# EAGLE design prototype_total_schematic_2355 (EAGLE 8.4.1)
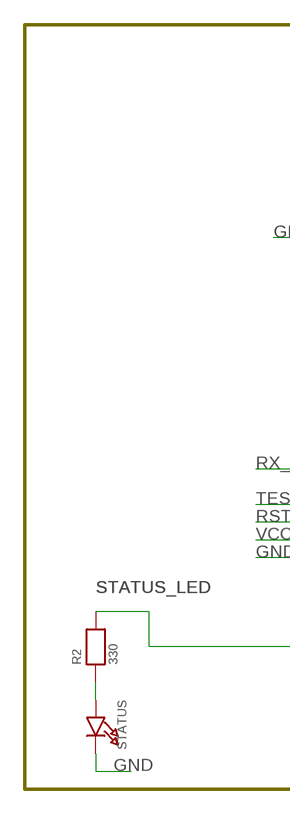
[diagram p0: schematic, sheet 1, part 1 of 2]
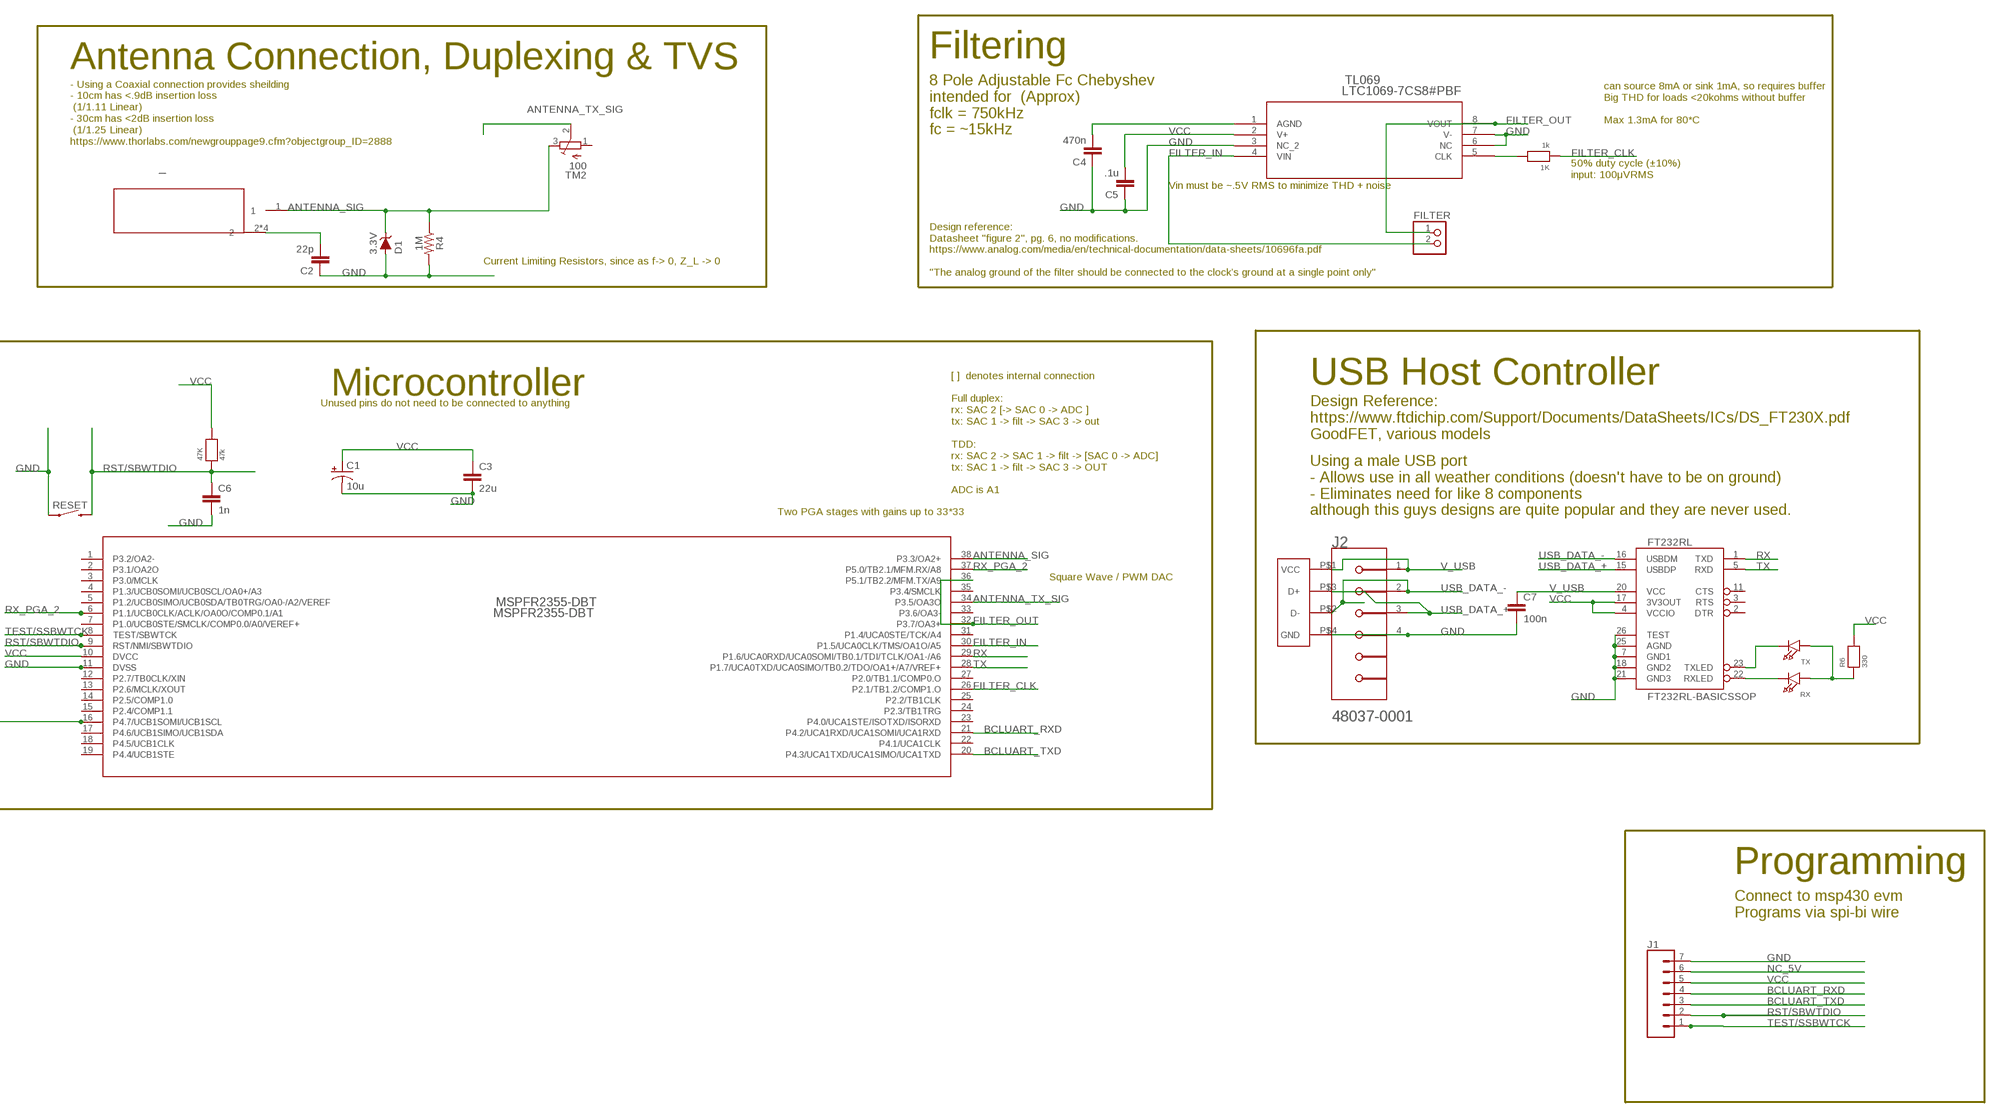
[diagram p1: schematic, sheet 1, part 2 of 2]

## Parts
1K  1k  RESISTOR0805  [0805]
47K  47k  RESISTOR0805  [0805]
_  5-1814400-1  [5-1814400-1]
C1  10u  10UF-POLAR-EIA6032-25V-10%  [EIA6032-NOM]
C2  22p  22UF-0805-6.3V-20%  [0805]
C3  22u  22UF-0805-6.3V-20%  [0805]
C4  470n  22UF-0805-6.3V-20%  [0805]
C5  .1u  22UF-0805-6.3V-20%  [0805]
C6  1n  22UF-0805-6.3V-20%  [0805]
C7  100n  22UF-0805-6.3V-20%  [0805]
D1  3.3V  DIODE-ZENER-MM3Z3V3T1G  [SOD-323]
FILTER  HEADER-1X2ROUND  [1X02_ROUND]
FT232RL  FT232RL-BASICSSOP  [SSOP28DB]
J1  CONN_07NO_SILK  [1X07_NO_SILK]
J2  MOLEX_48037-0001MOLEX_48037-0001_0_0  [MOLEX_48037-0001_0]
MSPFR2355-DBT  MSPFR2355-DBT  [SOP50P640X120-38N]
R2  330  RESISTOR0805  [0805]
R4  1M  2.0KOHM-0603-1/10W-5%  [0603]
R6  330  RESISTOR0805  [0805]
RESET  MOMENTARY-SWITCH-SPST-PTH-6.0MM  [TACTILE_SWITCH_PTH_6.0MM]
RX  LED0805  [CHIPLED_0805]
STATUS  LED0805  [CHIPLED_0805]
TL069  LTC1069-7CS8#PBF  [SO-8_S]
TM2  100  TRIMPOTTC33X  [TC33X]
TX  LED0805  [CHIPLED_0805]
U$1  USB-PCB  [PCB_USB]

## Nets
ANTENNA_SIG: _.1 D1.C MSPFR2355-DBT.38(P3.3/OA2+) R4.1 TM2.3(E)
ANTENNA_TX_SIG: MSPFR2355-DBT.34(P3.5/OA3O) TM2.2(S)
BCLUART_RXD: J1.4 MSPFR2355-DBT.21(P4.2/UCA1RXD/UCA1SOMI/UCA1RXD)
BCLUART_TXD: J1.3 MSPFR2355-DBT.20(P4.3/UCA1TXD/UCA1SIMO/UCA1TXD)
FILTER_CLK: 1K.1 MSPFR2355-DBT.26(P2.1/TB1.2/COMP1.O)
FILTER_IN: FILTER.2 MSPFR2355-DBT.30(P1.5/UCA0CLK/TMS/OA1O/A5) TL069.4(VIN)
FILTER_OUT: FILTER.1 MSPFR2355-DBT.32(P3.7/OA3+) MSPFR2355-DBT.36(P5.1/TB2.2/MFM.TX/A9) TL069.8(VOUT)
GND: C1.C(-) C2.1 C3.2 C4.1 C5.1 C6.2 C7.2 D1.A FT232RL.7(GND1) FT232RL.18(GND2) FT232RL.21(GND3) FT232RL.25(AGND) FT232RL.26(TEST) J1.7 J2.4 MSPFR2355-DBT.11(DVSS) R4.2 RESET.1 STATUS.C TL069.3(NC_2) TL069.6(NC) TL069.7(V-) U$1.P$4(GND)
N$1: 1K.2 TL069.5(CLK)
N$2: _.2 _.3 _.4 _.5 C2.2
N$3: C4.2 TL069.1(AGND)
N$19: R2.1 STATUS.A
N$20: FT232RL.22(RXLED) RX.C
N$21: FT232RL.23(TXLED) TX.C
N$22: R6.1 RX.A TX.A
NC_5V: J1.6
RST/SBWTDIO: 47K.1 C6.1 J1.2 MSPFR2355-DBT.9(RST/NMI/SBWTDIO) RESET.3
RX: FT232RL.1(TXD) MSPFR2355-DBT.29(P1.6/UCA0RXD/UCA0SOMI/TB0.1/TDI/TCLK/OA1-/A6)
RX_PGA_2: MSPFR2355-DBT.6(P1.1/UCB0CLK/ACLK/OA0O/COMP0.1/A1) MSPFR2355-DBT.37(P5.0/TB2.1/MFM.RX/A8)
STATUS_LED: MSPFR2355-DBT.16(P4.7/UCB1SOMI/UCB1SCL) R2.2
TEST/SSBWTCK: J1.1 MSPFR2355-DBT.8(TEST/SBWTCK)
TX: FT232RL.5(RXD) MSPFR2355-DBT.28(P1.7/UCA0TXD/UCA0SIMO/TB0.2/TDO/OA1+/A7/VREF+)
USB_DATA_+: FT232RL.15(USBDP) J2.3 U$1.P$3(D+)
USB_DATA_-: FT232RL.16(USBDM) J2.2 U$1.P$2(D-)
V_USB: C7.1 FT232RL.20(VCC) J2.1 U$1.P$1(VCC)
VCC: 47K.2 C1.A(+) C3.1 C5.2 FT232RL.4(VCCIO) FT232RL.17(3V3OUT) J1.5 MSPFR2355-DBT.10(DVCC) R6.2 TL069.2(V+)
Unconnected: FT232RL.2(DTR) FT232RL.3(RTS) FT232RL.11(CTS) MSPFR2355-DBT.1(P3.2/OA2-) MSPFR2355-DBT.2(P3.1/OA2O) MSPFR2355-DBT.5(P1.2/UCB0SIMO/UCB0SDA/TB0TRG/OA0-/A2/VEREF) MSPFR2355-DBT.7(P1.0/UCB0STE/SMCLK/COMP0.0/A0/VEREF+) MSPFR2355-DBT.12(P2.7/TB0CLK/XIN) MSPFR2355-DBT.13(P2.6/MCLK/XOUT) MSPFR2355-DBT.14(P2.5/COMP1.0) MSPFR2355-DBT.15(P2.4/COMP1.1) MSPFR2355-DBT.17(P4.6/UCB1SIMO/UCB1SDA) MSPFR2355-DBT.18(P4.5/UCB1CLK) MSPFR2355-DBT.19(P4.4/UCB1STE) MSPFR2355-DBT.22(P4.1/UCA1CLK) MSPFR2355-DBT.23(P4.0/UCA1STE/ISOTXD/ISORXD) MSPFR2355-DBT.24(P2.3/TB1TRG) MSPFR2355-DBT.25(P2.2/TB1CLK) MSPFR2355-DBT.27(P2.0/TB1.1/COMP0.O) MSPFR2355-DBT.31(P1.4/UCA0STE/TCK/A4) MSPFR2355-DBT.35(P3.4/SMCLK) TM2.1(A)

## Notes on the sheet
- Antenna Connection, Duplexing & TVS | Filtering
- can source 8mA or sink 1mA, so requires buffer
  Big THD for loads <20kohms without buffer
  
  Max 1.3mA for 80*C
- 8 Pole Adjustable Fc Chebyshev
  intended for  (Approx)
  fclk = 750kHz 
  fc = ~15kHz
- - Using a Coaxial connection provides sheilding
  - 10cm has <.9dB insertion loss
   (1/1.11 Linear)
  - 30cm has <2dB insertion loss
   (1/1.25 Linear)
  https://www.thorlabs.com/newgrouppage9.cfm?objectgroup_ID=2888
- 50% duty cycle (±10%)
  input: 100μVRMS
- Vin must be ~.5V RMS to minimize THD + noise
- Current Limiting Resistors, since as f-> 0, Z_L -> 0
- Design reference: 
  Datasheet "figure 2", pg. 6, no modifications.
  https://www.analog.com/media/en/technical-documentation/data-sheets/10696fa.pdf
  
  "The analog ground of the filter should be connected to the clock’s ground at a single point only"
- Microcontroller | USB Host Controller
- Unused pins do not need to be connected to anything
- Design Reference:
  https://www.ftdichip.com/Support/Documents/DataSheets/ICs/DS_FT230X.pdf
  GoodFET, various models
- [ ]  denotes internal connection
  
  Full duplex:
  rx: SAC 2 [-> SAC 0 -> ADC ]
  tx: SAC 1 -> filt -> SAC 3 -> out
  
  TDD:
  rx: SAC 2 -> SAC 1 -> filt -> [SAC 0 -> ADC]
  tx: SAC 1 -> filt -> SAC 3 -> OUT 
  
  ADC is A1
- Two PGA stages with gains up to 33*33
- Using a male USB port
  - Allows use in all weather conditions (doesn't have to be on ground)
  - Eliminates need for like 8 components 
  although this guys designs are quite popular and they are never used.
- Square Wave / PWM DAC
- Programming
- Connect to msp430 evm
  Programs via spi-bi wire

## Power pins joined to a net without a drawn wire
P1.3/UCB0SOMI/UCB0SCL/OA0+/A3: MSPFR2355-DBT.4(P1.3/UCB0SOMI/UCB0SCL/OA0+/A3)
P3.0/MCLK: MSPFR2355-DBT.3(P3.0/MCLK)
P3.6/OA3-: MSPFR2355-DBT.33(P3.6/OA3-)

## Library data of the parts
1K 47K R2 R6 = microbuilder:RESISTOR: Resistors 0402 - 0402 Surface Mount Package 22 Ohm 1% 1/16W [Digikey: 311-22.0LRTR-ND] 33 Ohm 5% 1/16W 1.0K 5% 1/16W 1.5K 5% 1/16W 2.0K 1% 1/16W 10.0K 1% 1/16W [Digikey: 311-10.0KLRTR-ND] 10.0K 5% 1/16W [Digikey: RMCF0402JT10K0TR-ND] 12.1K 1% 1/16W [Digikey: 311-22.0LRTR-ND] 100.0K 5% 1/16W 0603 - 0603 Surface Mount Package 0 Ohm 1/10 Watt 1% Resistor 15 Ohm 1/10 Watt 1% Resistor 33 Ohm 1/10 Watt 1% Resistor 49.9 Ohm 1/10 Watt 1% Resistor 100 Ohm 1/10 Watt 1% Resistor 150 Ohm 1/10 Watt 1% Resistor 240 Ohm 1/10 Watt 1% Resistor 390 Ohm 1/10 Watt 1% Resistor 560 Ohm 1/10 Watt 1% Resistor 680 Ohm 1/10 Watt 1% Resistor 750 Ohm 1/10 Watt 1% Resistor 1.0K Ohm 1/10 Watt 1% Resistor 1.5K Ohm 1/10 Watt 1% Resistor 2.0K Ohm 1/10 Watt 1% Resistor 2.2K Ohm 1/10 Watt 1% Resistor 3.3K Ohm 1/10 Watt 1% Resistor 4.7K Ohm 1/10 Watt 1% Resistor 10.0K Ohm 1/10 Watt 1% Resistor 12.0K Ohm 1/10 Watt 1% Resistor 12.1K Ohm 1/10 Watt 1% Resistor 20.0K Ohm 1/10 Watt 1% Resistor 33.0K Ohm 1/10 Watt 1% Resistor 100.0K Ohm 1/10 Watt 1% Resistor 0805 - 0805 Surface Mount Package 0 Ohm 1/8 Watt 1% Resistor 33 Ohm 1/8 Watt 1% Resistor 100 Ohm 1/8 Watt 1% Resistor 150 Ohm 1/8 Watt 1% Resistor 200 Ohm 1/8 Watt 1% Resistor 240 Ohm 1/8 Watt 1% Resistor 330 Ohm 1/8 Watt 1% Resistor 390 Ohm 1/8 Watt 1% Resistor 470 Ohm 1/8 Watt 1% Resistor 1.0K Ohm 1/8 Watt 1% Resistor 1.5K Ohm 1/8 Watt 1% Resistor 2.0K Ohm 1/8 Watt 1% Resistor 4.7K Ohm 1/8 Watt 1% Resistor 5.1K Ohm 1/8 Watt 1% Resistor 5.6K Ohm 1/8 Watt 1% Resistor 10.0K Ohm 1/8 Watt 1% Resistor 22.0K Ohm 1/8 Watt 1% Resistor 33.0K Ohm 1/8 Watt 1% Resistor 100K Ohm 1/8 Watt 1% Resistor 1206 - 1206 Surface Mount Package 2012 - 2010 Surface Mount Package 0.11 Ohm 1/2 Watt 1% Resistor - Digikey: RHM.11UCT-ND
_ = TTE:5-1814400-1; MANUFACTURER_PART_NUMBER: 518144001; VENDOR: TE Connectivity
C1 = SparkFun-Capacitors:10UF-POLAR: 10.0µF polarized capacitors A capacitor is a passive two-terminal electrical component used to store electrical energy temporarily in an electric field.; PROD_ID: CAP-12984; VALUE: 10µF
C2-C7 = SparkFun-Capacitors:22UF: 22µF ceramic capacitors A capacitor is a passive two-terminal electrical component used to store electrical energy temporarily in an electric field.; PROD_ID: CAP-08402; VALUE: 22uF
D1 = SparkFun-DiscreteSemi:DIODE-ZENER: Zener Diode A Zener diode allows current to flow from its anode to its cathode like a normal semiconductor diode, but it also permits current to flow in the reverse direction when its "Zener voltage" is reached. - WIkipedia; PROD_ID: DIO-11284
FILTER = microbuilder:HEADER-1X2: PIN HEADER
FT232RL = SparkFun:FT232RL-BASIC: USB UART This is the simplified version of the FT232RL unit. Only what you need, nothing you don't. Spark Fun Electronics SKU : COM-00650
J1 = SparkFun-Connectors:CONN_07: Multi connection point. Often used as Generic Header-pin footprint for 0.1 inch spaced/style header connections On any of the 0.1 inch spaced packages, you can populate with these: Break Away Headers - Straight <https://www.sparkfun.com/products/116> (PRT-00116) Break Away Male Headers - Right Angle <https://www.sparkfun.com/products/553> (PRT-00553) Female Headers <https://www.sparkfun.com/products/115> (PRT-00115) Break Away Headers - Machine Pin <https://www.sparkfun.com/products/117> (PRT-00117) Break Away Female Headers - Swiss Machine Pin <https://www.sparkfun.com/products/743> (PRT-00743) For SCREWTERMINALS and SPRING TERMINALS visit here: Screw Terimnals on SparkFun.com <https://www.sparkfun.com/search/results?term=Screw+Terminals> (5mm/3.5mm/2.54mm spacing) This device is also useful as a general connection point to wire up your design to another part of your project. Our various solder wires solder well into these plated through hole pads. Hook-Up Wire - Assortment (Stranded, 22 AWG) <https://www.sparkfun.com/products/11375> (PRT-11375) Hook-Up Wire - Assortment (Solid Core, 22 AWG) <https://www.sparkfun.com/products/11367> (PRT-11367) View the entire wire category on our website here <https://www.sparkfun.com/categories/141> Special notes: Molex polarized connector foot print use with SKU : PRT-08231 with associated crimp pins and housings. 1MM SMD Version SKU: PRT-10208 NOTES ON THE VARIANTS LOCK and LOCK_LONGPADS... This footprint was designed to help hold the alignment of a through-hole component (i.e. 6-pin header) while soldering it into place. You may notice that each hole has been shifted either up or down by 0.005 of an inch from it's more standard position (which is a perfectly straight line). This slight alteration caused the pins (the squares in the middle) to touch the edges of the holes. Because they are alternating, it causes a "brace" to hold the component in place. 0.005 has proven to be the perfect amount of "off-center" position when using our standard breakaway headers. Although looks a little odd when you look at the bare footprint, once you have a header in there, the alteration is very hard to notice. Also,if you push a header all the way into place, it is covered up entirely on the bottom side.
J2 = TTE:MOLEX_48037-0001: Universal Serial Bus (USB) Shielded I/O Plug, Type A, Right Angle, Through Hole, 0.76µm Gold (Au) Plating, PCB Thickness 1.20mm-1.60mm, Lead-Free; CENTROID_NOT_SPECIFIED: No; DATASHEET: http://www.molex.com/elqNow/elqRedir.htm?ref=http://www.molex.com/pdm_docs/sd/480370001_sd.pdf; DIGIKEY_DESCRIPTION: CONN PLUG USB 4POS RT ANG PCB; DIGIKEY_PART_NUMBER: WM17117-ND; IMPORTED_FROM: octopart; IS_FEMALE: yes; LEAD_FREE: yes; MF: Molex; MOUSER_PART_NUMBER: 538-48037-0001; MPN: 48037-0001; NUM_PINS: 2; OCTOPART_PART_NUMBER: 6671af1c981eb9b6; PACKAGE: CONN_USB_PTH_18MM8_12MM0; PREFIX: J; ROHS: yes; TEMPERATURE_RANGE_HIGH: +85°C; TEMPERATURE_RANGE_LOW: -20°C
MSPFR2355-DBT = TTE:MSPFR2355-DBT
R4 = SparkFun-Resistors:2.0KOHM: 2kΩ resistor A resistor is a passive two-terminal electrical component that implements electrical resistance as a circuit element. Resistors act to reduce current flow, and, at the same time, act to lower voltage levels within circuits. - Wikipedia; PROD_ID: RES-08296; VALUE: 2.0k
RESET = SparkFun-Switches:MOMENTARY-SWITCH-SPST: Momentary Switch (Pushbutton) - SPST Normally-open (NO) SPST momentary switches (buttons, pushbuttons). Variants PTH-12MM - 12mm square, through-hole Momentary Pushbutton Switch - 12mm Square <https://www.sparkfun.com/products/9190> (COM-09190) PTH-6.0MM, PTH-6.0MM-KIT - 6.0mm square, through-hole Mini Pushbutton Switch <https://www.sparkfun.com/products/97> (COM-00097) KIT package intended for soldering kit's - only one side of pads' copper is exposed. PTH-RIGHT-ANGLE-KIT - Right-angle, through-hole Right Angle Tactile Button <https://www.sparkfun.com/products/10791> - Used on SparkFun BigTime Watch Kit <https://www.sparkfun.com/products/11734> SMD-12MM - 12mm square, surface-mount Tactile Button - SMD (12mm) <https://www.sparkfun.com/products/12993> (COM-12993) Used on SparkFun PicoBoard <https://www.sparkfun.com/products/11888> SMD-4.5MM - 4.5mm Square Trackball Switch Used on SparkFun Blackberry Trackballer Breakout <https://www.sparkfun.com/products/13169> SMD-4.6MMX2.8MM - 4.60mm x 2.80mm, surface mount Used on SparkFun SAMD21 Mini Breakout <https://www.sparkfun.com/products/13664> SMD-5.2MM, SMD-5.2-REDUNDANT - 5.2mm square, surface-mount Mini Pushbutton Switch - SMD <https://www.sparkfun.com/products/8720> (COM-08720) Used on Arduino Pro Mini <https://www.sparkfun.com/products/11114> REDUNDANT package connects both switch circuits together SMD-6.0X3.5MM - 6.0 x 3.5mm, surface mount Momentary Reset Switch SMD <https://www.sparkfun.com/products/8229> (COM-08229) SMD-6.2MM-TALL - 6.2mm square, surface mount Tactile Button - SMD (6mm) <https://www.sparkfun.com/products/12992> Used on SparkFun Digital Sandbox <https://www.sparkfun.com/products/12651> SMD-RIGHT-ANGLE - Right-angle, surface mount Used on SparkFun Block for Intel® Edison - Arduino <https://www.sparkfun.com/products/13036>; PROD_ID: SWCH-08441; SF_SKU: COM-00097
RX STATUS TX = microbuilder:LED: LED 0603 - 0603 Surface Mount Package 2mA: Green LED - Low Power (3.9mcd, 2ma, 1.7Vf) - Digikey: 475-2709-2-ND Orange LED - Low Power (9.8mcd, 2ma, 1.8Vf) - Digikey: 475-1194-2-ND Red LED - Low Power (5mcd, 2ma, 1.8Vf) - Digikey: 475-1195-2-ND Yellow LED - Low Power (7mcd, 2ma, 1.8Vf) - Digikey: 475-1196-2-ND 5mA: Blue LED - Low Power (17mcd, 5ma, 2.9Vf) - Digikey: LNJ937W8CRACT-ND 0805 - 0805 Surface Mount Package 2mA: Red LED (8.8mcd, 2mA, 1.8Vf, Clear) - Low Power [Digikey: 475-2510-1-ND] Green LED (5mcd, 2mA, 1.8Vf, Clear) - Low Power [Digikey: 475-2730-1-ND] Yellow LED (11.3mcd, 2mA, 1.8Vf, Clear) - Low Power [Digikey: 475-2555-1-ND] 20mA: Red LED (104mcd, 20mA, Diffused) - LS R976 [Digikey: 475-1278-6-ND] Red LED (12mcd, 20mA, 2.0Vf, Clear) - APT2012EC [Digikey: 754-1128-1-ND] Green LED (15mcd, 20mA, 2.2Vf, Clear) - APT2012GC [Digikey: 754-1131-1-ND] Orange LED (160mcd, 20mA, 2.1Vf, Clear) - APT2012SECK [Digikey: 754-1130-1-ND] 1206 - 1206 Surface Mount Package Green LED (26mcd, 20mA, Diffused) - LG N971 [Digikey: 475-1407-6-ND] Red LED (15mcd, 20mA, Diffused) - LH N974 [Digikey: 475-1416-6-ND]
TL069 = TTE:LTC1069-7CS8#PBF; DESCRIPTION: LTC1069-7 - Linear Phase 8th Order Lowpass Filter; DIGI-KEY_PART_NUMBER: LTC1069-7CS8#PBF-ND; DIGI-KEY_PURCHASE_URL: https://www.digikey.com/product-detail/en/linear-technology-analog-devices/LTC1069-7CS8-PBF/LTC1069-7CS8-PBF-ND/889060?utm_source=snapeda&utm_medium=aggregator&utm_campaign=symbol; MF: Linear Technology; MP: LTC1069-7CS8#PBF; PACKAGE: SOIC-8 Linear Technology
TM2 = adafruit:TRIMPOT: SMT trimmer potentiometer part number TC33X http://www.ladyada.net/library/eagle
U$1 = TTE:USB-PCB

## Board
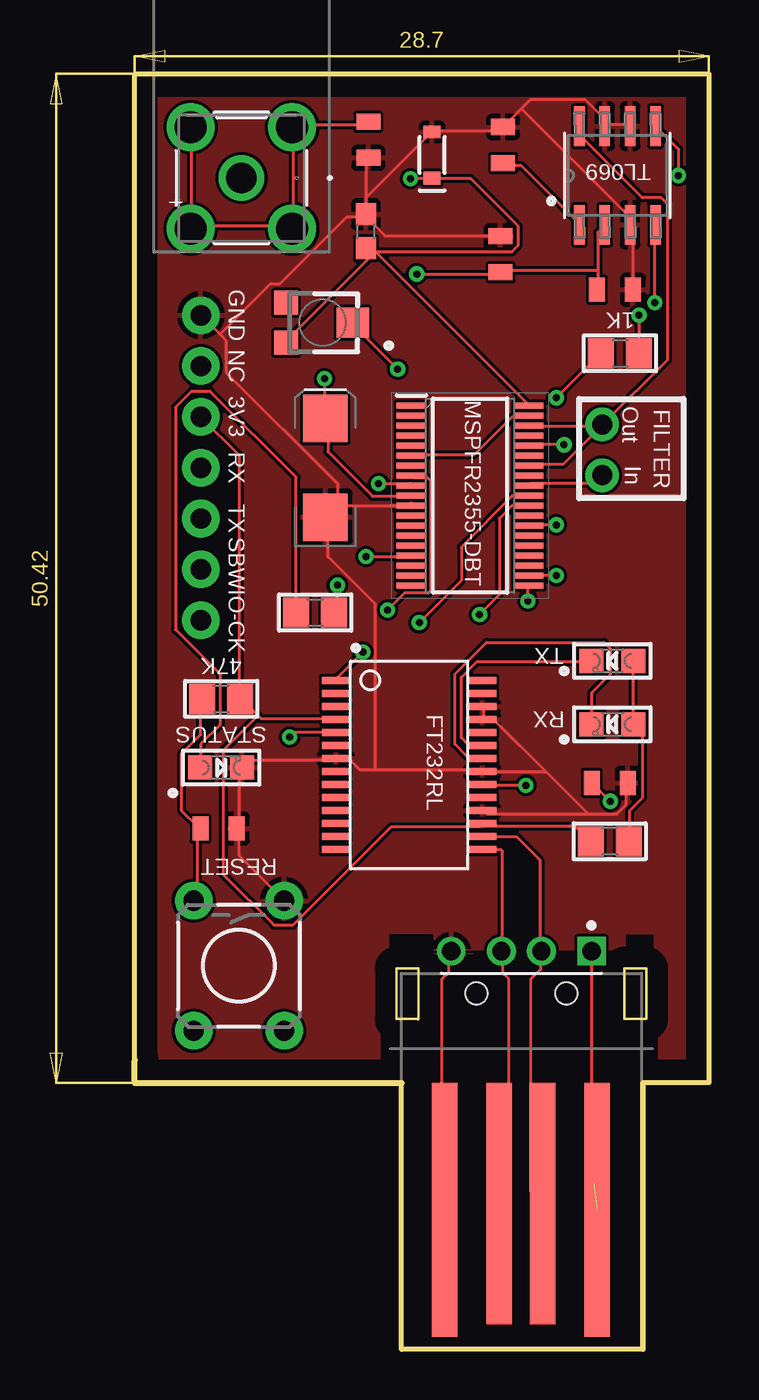
[diagram p2: board, top side]
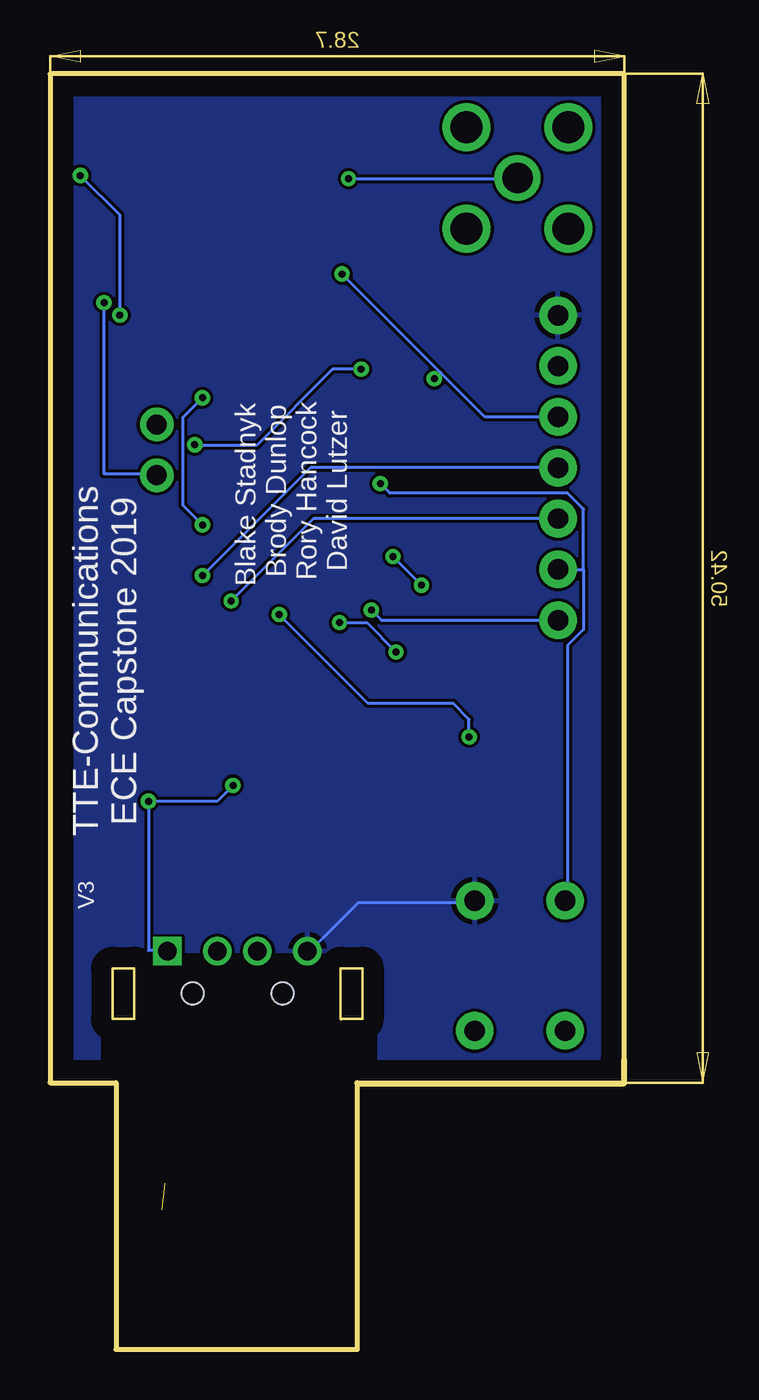
[diagram p3: board, bottom side, seen from below]

Size 28.7 x 63.75 mm. Coordinates in mm from the lower left corner, seen from the top.
Outline: 13.34,13.31 13.34,0 25.4,0 25.4,13.34 28.7,13.34 28.7,63.75 0,63.75 0,14.45
Outline: 13.34,13.31 13.34,13.34
Outline: 0,13.59 0,14.45
Outline: 13.34,13.31 0,13.31 0,14.45
Copper layers (1*16): Top 0.035mm / dielectric 1.5mm / Bottom 0.035mm
Design rules "default": minimum track width 6mil, minimum drill 0.35mm, track to track 6mil, track to pad 6mil, pad to pad 6mil, via to via 6mil, smd to smd 6mil, copper to edge 40mil, drill to drill 6mil, minimum pad ring 10mil, minimum via ring 8mil, stop-mask expansion 4mil, vias tented up to drill 0mil, thermal gap 10mil
tRestrict: area 12.4,11 to 26.1,19.7
bRestrict: area -0.4,-0.3 to 12.6,13.2; area 12.4,11 to 26.1,19.7

### Footprints (pad centres in the part's own frame; a part is rotated, then mirrored left to right if it is on the bottom)
0805 = smd 1.3 x 1.5: 1 -0.95,0; 2 0.95,0
5-1814400-1 = drill 1.524 pad 2.032: 1 0,0 | drill 1.6 pad 2.083: 2 -2.54,2.54; 3 -2.54,-2.54; 4 2.54,-2.54; 5 2.54,2.54
EIA6032-NOM = smd 2.37 x 2.23: A 2.47,0; C -2.47,0
0805' = smd 0.8 x 1.2: 1 -0.9,0; 2 0.9,0
SOD-323 = smd 0.63 x 0.83: A 1.15,0; C -1.15,0
1X02_ROUND = drill 1 pad 1.676: 1 -1.27,0; 2 1.27,0
SSOP28DB = smd 0.348 x 1.397: 1 -4.225,-3.656; 2 -3.575,-3.656; 3 -2.925,-3.656; 4 -2.275,-3.656; 5 -1.625,-3.656; 6 -0.975,-3.656; 7 -0.325,-3.656; 8 0.325,-3.656; 9 0.975,-3.656; 10 1.625,-3.656; 11 2.275,-3.656; 12 2.925,-3.656; 13 3.575,-3.656; 14 4.225,-3.656; 15 4.225,3.656; 16 3.575,3.656; 17 2.925,3.656; 18 2.275,3.656; 19 1.625,3.656; 20 0.975,3.656; 21 0.325,3.656; 22 -0.325,3.656; 23 -0.975,3.656; 24 -1.625,3.656; 25 -2.275,3.656; 26 -2.925,3.656; 27 -3.575,3.656; 28 -4.225,3.656
1X07_NO_SILK = drill 1.016 pad 1.88: 1 0,0; 2 2.54,0; 3 5.08,0; 4 7.62,0; 5 10.16,0; 6 12.7,0; 7 15.24,0
MOLEX_48037-0001_0 = drill 0.92 pad 1.42 square: 1 3.5,10.5 | drill 0.92 pad 1.42: 2 1,10.5; 3 -1,10.5; 4 -3.5,10.5 | hole 1.1: -2.25,8.4; 2.25,8.4
SOP50P640X120-38N = smd 1.475 x 0.3: 1 -2.938,4.5; 2 -2.938,4; 3 -2.938,3.5; 4 -2.938,3; 5 -2.938,2.5; 6 -2.938,2; 7 -2.938,1.5; 8 -2.938,1; 9 -2.938,0.5; 10 -2.938,0; 11 -2.938,-0.5; 12 -2.938,-1; 13 -2.938,-1.5; 14 -2.938,-2; 15 -2.938,-2.5; 16 -2.938,-3; 17 -2.938,-3.5; 18 -2.938,-4; 19 -2.938,-4.5; 20 2.938,-4.5; 21 2.938,-4; 22 2.938,-3.5; 23 2.938,-3; 24 2.938,-2.5; 25 2.938,-2; 26 2.938,-1.5; 27 2.938,-1; 28 2.938,-0.5; 29 2.938,0; 30 2.938,0.5; 31 2.938,1; 32 2.938,1.5; 33 2.938,2; 34 2.938,2.5; 35 2.938,3; 36 2.938,3.5; 37 2.938,4; 38 2.938,4.5
0603 = smd 1.1 x 1: 1 -0.85,0; 2 0.85,0
TACTILE_SWITCH_PTH_6.0MM = drill 1.016 pad 1.88: 1 -3.251,2.261; 2 3.251,2.261; 3 -3.251,-2.261; 4 3.251,-2.261
CHIPLED_0805 = smd 1.2 x 1.2: A 0,-1.05; C 0,1.05
SO-8_S = smd 1.981 x 0.533: 1 -2.464,1.905; 2 -2.464,0.635; 3 -2.464,-0.635; 4 -2.464,-1.905; 5 2.464,-1.905; 6 2.464,-0.635; 7 2.464,0.635; 8 2.464,1.905
TC33X = smd 1.2 x 1.2: 1 -1,-1.825; 3 1,-1.825 | smd 1.5 x 1.6: 2 0,1.5
PCB_USB = smd 1.27 x 12.7: P$1 -3.81,6.35; P$4 3.81,6.35 | smd 1.27 x 12.065: P$2 -1.079,6.032; P$3 1.079,6.032

### Placement (x,y rotation side)
1K  24.26,49.78 0 top
47K  4.32,32.51 0 top
_  5.33,58.55 0 top
C1  9.52,44.07 90 top
C2  22p  [0805']  11.68,60.45 90 top
C3  22u  [0805']  24,52.96 0 top
C4  470n  [0805']  18.41,60.2 270 top
C5  .1u  [0805']  18.29,54.74 270 top
C6  1n  [0805']  4.19,26.04 0 top
C7  100n  [0805']  23.75,28.32 0 top
D1  14.86,59.69 90 top
FILTER  23.37,44.96 270 top
FT232RL  13.72,29.21 270 top
J1  3.3,36.45 90 top
J2  19.33,9.4 0 top
MSPFR2355-DBT  16.76,42.67 0 top
R2  9.02,36.83 0 top
R4  11.56,55.88 90 top
R6  23.75,25.4 180 top
RESET  5.21,19.18 270 top
RX  23.88,31.24 90 top
STATUS  4.32,29.08 270 top
TL069  24.13,58.67 90 top
TM2  9.4,51.31 270 top
TX  23.88,34.42 90 top
U$1  19.3,13.34 180 top

### Tracks (layer width: path | path; a pad name or v marks a point on that pad's centre or on a via)
ANTENNA_SIG  (via drill 0.35)
  Top 0.152: 12.03,54.86 11.72,54.86 R4.1 12.03,54.86 | 12.03,54.86 18.86,54.86 19.18,55.18 19.18,56.13 16.8,58.52 14.89,58.52 D1.C 14.73,58.52 v13.78,58.52 | 12.03,54.86 7.59,50.42 TM2.3 | 12.03,54.86 19.65,47.24 MSPFR2355-DBT.38
  Bottom 0.152: v13.78,58.52 5.37,58.52 _.1
ANTENNA_TX_SIG  (via drill 0.35)
  Top 0.152: v13.15,48.99 10.92,51.21 TM2.2 | 19.65,45.18 MSPFR2355-DBT.34 19.74,45.21 v21.46,45.21
  Bottom 0.152: v13.15,48.99 14.57,48.99 18.38,45.18 21.43,45.18 v21.46,45.21
BCLUART_RXD  (via drill 0.35)
  Top 0.152: v21.08,38.67 19.81,38.67 MSPFR2355-DBT.21
  Bottom 0.152: v21.08,38.67 15.68,44.07 J1.4
BCLUART_TXD  (via drill 0.35)
  Top 0.152: v19.65,37.4 19.65,38.04 MSPFR2355-DBT.20
  Bottom 0.152: v19.65,37.4 15.53,41.53 J1.3
FILTER_CLK  (via drill 0.35)
  Top 0.152: v21.08,41.21 19.81,41.21 MSPFR2355-DBT.26 | 1K.1 v21.08,47.56
  Bottom 0.152: v21.08,47.56 22.07,46.57 22.07,42.2 v21.08,41.21
FILTER_IN  (via drill 0.35)
  Top 0.152: MSPFR2355-DBT.30 19.81,43.28 22.99,43.28 23.3,43.59 FILTER.2 | v26,52.32 26,56.13 TL069.4
  Bottom 0.152: v26,52.32 26,43.75 23.46,43.75 FILTER.2
FILTER_OUT
  Top 0.152: 23.3,46.13 21.4,44.23 19.81,44.23 MSPFR2355-DBT.32 | 23.3,46.13 19.81,46.13 MSPFR2355-DBT.36 | 23.3,46.13 FILTER.1 23.46,46.29 26.64,49.47 26.64,57.25 26.32,57.56 25.37,57.56 22.35,60.58 22.35,61.06 TL069.8
GND
  Top 0.152: C3.2 24.89,52.96 24.89,56.13 TL069.3 24.73,56.29 24.73,56.61 19.34,62.01 | TL069.6 24.73,61.21 23.62,61.21 TL069.7 23.46,61.21 23.46,61.53 22.51,62.48 19.81,62.48 19.34,62.01 | 11.56,57.56 11.56,59.47 C2.1 | 11.56,57.56 R4.2 11.56,56.61 | 11.56,56.61 12.51,55.66 18.22,55.66 C5.1 | 11.56,57.56 14.73,60.74 D1.A 14.89,60.9 18.22,60.9 18.38,61.06 C4.1 18.54,61.21 19.34,62.01 | 10.13,42.16 13.78,42.16 MSPFR2355-DBT.11 | 10.13,42.16 9.65,41.69 C1.C | 10.13,42.16 10.13,43.28 4.57,48.83 4.57,50.42 4.26,50.74 | J1.7 4.26,50.74 | 10.13,42.16 C1.C | 11.56,56.61 10.6,56.61 7.27,53.28 6.79,53.28 4.26,50.74 | FT232RL.26 17.43,32 17.43,31.53 FT232RL.25 17.43,31.37 18.07,31.37 20.55,28.89 | 22.67,26.76 17.59,26.76 17.43,26.92 FT232RL.18 | 22.67,26.76 24.1,26.76 24.58,27.24 24.58,28.19 C7.2 | 18.07,28.83 17.43,28.83 FT232RL.21 | RESET.1 7.43,22.48 5.21,24.7 5.21,25.97 C6.2 5.21,26.13 5.21,28.83 5.37,28.99 STATUS.C 5.52,29.15 5.84,29.46 9.97,29.46 FT232RL.7 10.13,29.46 10.76,29.46 11.24,28.99 12.03,28.99 | 12.03,28.99 17.27,28.99 FT232RL.21 | U$1.P$4 15.37,7.08 15.37,18.51 15.68,18.83 15.68,19.75 | 12.03,28.99 12.03,37.24 9.65,39.62 9.65,41.53 C1.C | 20.55,28.89 22.67,26.76 | FT232RL.21 20.55,28.89 | 15.68,19.75 J2.4 15.68,19.75
  Bottom 0.152: 15.68,19.94 13.3,22.32 7.59,22.32 RESET.1
  pour Bottom: 29.34,64.95 -1.4,64.57 -0.63,12.88 29.08,14.15
  pour Top: 29.9,13.06 -1.02,13.06 -1.02,64.44 29.9,64.44
N$1  (via drill 0.35)
  Top 0.152: v25.21,51.69 1K.2 | TL069.5 27.18,59.99 v27.18,58.67
  Bottom 0.152: v27.18,58.67 25.21,56.7 v25.21,51.69
N$2
  Top 0.152: 2.83,56.13 2.83,61.06 _.2 | C2.2 11.56,61.21 7.91,61.21 _.5 7.91,61.06 7.91,56.13 _.4 7.75,56.13 2.83,56.13 | 2.83,56.13 _.3
N$3
  Top 0.152: C4.2 18.54,59.15 19.34,59.15 22.19,56.29 TL069.1
N$19
  Top 0.152: STATUS.A 3.3,29.15 3.3,30.26 4.26,31.21 4.26,33.75 2.03,35.97 2.03,47.09 2.83,47.88 3.78,47.88 8.06,43.59 8.06,36.92 R2.1
N$20
  Top 0.152: RX.C 22.83,31.37 22.83,32.8 23.78,33.75 23.78,35.02 23.46,35.34 17.59,35.34 16,33.75 16,30.26 16.64,29.62 17.27,29.62 FT232RL.22
N$21
  Top 0.152: TX.C 22.67,34.39 17.11,34.39 16.32,33.59 16.32,30.57 16.64,30.26 17.27,30.26 FT232RL.23
N$22
  Top 0.152: TX.A 24.89,34.39 24.89,31.37 RX.A 25.05,31.21 25.37,30.89 25.37,27.56 24.73,26.92 24.73,25.5 R6.1
RST/SBWTDIO  (via drill 0.35)
  Top 0.152: RESET.3 2.98,22.48 3.14,22.64 3.14,25.97 C6.1 3.14,26.13 2.35,26.92 2.35,29.78 3.3,30.73 3.3,32.48 47K.1 | v12.19,43.28 13.78,43.28 MSPFR2355-DBT.9
  Bottom 0.152: v12.19,43.28 11.72,42.8 2.83,42.8 2.03,42 2.03,38.99 | J1.2 2.03,38.99 | 2.03,38.99 2.03,35.97 2.83,35.18 2.83,22.48 RESET.3
RX  (via drill 0.35)
  Top 0.152: v11.4,34.86 10.13,33.59 FT232RL.1 | MSPFR2355-DBT.29 19.65,42.64 18.86,42.64 16.32,40.1 16.32,38.42 v14.22,36.32
  Bottom 0.152: v14.22,36.32 12.86,36.32 v11.4,34.86
RX_PGA_2
  Top 0.152: MSPFR2355-DBT.6 13.94,44.7 16.95,44.7 18.86,46.61 19.65,46.61 MSPFR2355-DBT.37
STATUS_LED  (via drill 0.35)
  Top 0.152: v11.56,39.62 13.78,39.62 MSPFR2355-DBT.16 | v10.13,38.19 10.13,37.08 9.97,36.92 R2.2
  Bottom 0.152: v10.13,38.19 v11.56,39.62
TEST/SSBWTCK  (via drill 0.35)
  Top 0.152: v12.64,36.96 13.48,37.79 14.66,37.79 14.79,37.93 14.79,43.42 14.63,43.58 13.92,43.58 MSPFR2355-DBT.8
  Bottom 0.152: J1.1 12.13,36.45 v12.64,36.96
TX  (via drill 0.35)
  Top 0.152: 10.13,30.89 FT232RL.5 7.98,30.83 v7.75,30.61 | MSPFR2355-DBT.28 19.65,42.16 18.86,42.16 18.22,41.53 18.22,37.72 v17.24,36.73
  Bottom 0.152: v17.24,36.73 12.8,32.29 8.54,32.29 7.75,31.5 v7.75,30.61
USB_DATA_+
  Top 0.152: U$1.P$3 18.22,7.4 18.7,7.87 18.7,18.51 18.38,18.83 18.38,19.78 18.33,19.83 J2.3 18.38,19.9 18.38,24.9 18.29,24.99 FT232RL.15
USB_DATA_-
  Top 0.152: U$1.P$2 19.81,7.87 19.81,18.51 20.29,18.99 20.29,19.78 20.33,19.82 J2.2 20.33,20.37 20.24,20.46 20.24,24.46 19.07,25.64 FT232RL.16
V_USB  (via drill 0.35)  (1 unrouted)
  Top 0.152: v23.78,27.4 22.99,28.19 C7.1 | v19.56,28.19 17.27,28.19 FT232RL.20 | 22.81,11.81 22.83,11.83 22.83,12.01 22.96,12.01 22.96,8.31 22.96,12.75 22.83,12.88 J2.1
  Bottom 0.152: 22.84,19.94 22.83,19.94 | 22.84,19.94 23.78,19.94 v23.78,27.4 20.35,27.4 v19.56,28.19 | J2.1 22.83,19.94 22.84,19.94
VCC  (via drill 0.35)
  Top 0.152: MSPFR2355-DBT.10 13.78,42.64 11.87,42.64 9.65,44.86 9.65,46.45 C1.A 9.49,46.61 v9.49,48.51 | 23.15,53.91 23.15,55.82 23.46,56.13 TL069.2 | 23.15,53.91 23.15,52.96 C3.1 | 23.15,53.91 18.38,53.91 C5.2 18.22,53.75 v14.1,53.75 | R6.2 22.67,25.5 22.04,26.13 17.43,26.13 FT232RL.17 17.27,26.13 12.83,26.13 7.91,21.21 6.95,21.21 4.41,23.75 4.41,29.94 6.16,31.69 | 6.16,31.69 5.37,32.48 47K.2 5.21,32.64 5.21,44.7 J1.5 | 6.16,31.69 6.32,31.53 9.97,31.53 FT232RL.4
  Bottom 0.152: 9.18,48.83 6.95,46.61 J1.5 | 9.18,48.83 v14.1,53.75 | 9.18,48.83 v9.49,48.51

### Text on the board
tPlace: Out | In
tNames: GND | NC | 3V3 | RX | TX | SBWIO-CK
bNames: Blake Stadnyk / Brody Dunlop / Rory Hancock / David Lutzer | TTE-Communications / ECE Capstone 2019 | V3